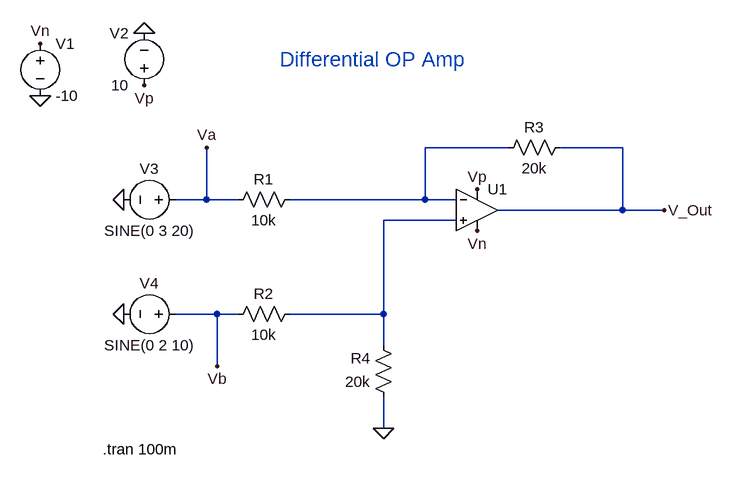
[diagram p0: schematic Differential_OP_Amp.asc]
Differential_OP_Amp.asc, the LTspice schematic file:
Version 4.1
SHEET 1 880 680
WIRE 256 48 128 48
WIRE 432 48 336 48
WIRE -208 128 -208 48
WIRE -208 128 -256 128
WIRE -160 128 -208 128
WIRE 128 128 128 48
WIRE 128 128 -80 128
WIRE 176 128 128 128
WIRE 432 144 432 48
WIRE 432 144 240 144
WIRE 496 144 432 144
WIRE 176 160 64 160
WIRE -192 304 -256 304
WIRE -160 304 -192 304
WIRE 64 304 64 160
WIRE 64 304 -80 304
WIRE 64 352 64 304
WIRE -192 384 -192 304
WIRE 64 480 64 432
FLAG -304 -128 0
FLAG -464 -32 0
FLAG -336 128 0
FLAG -336 304 0
FLAG -208 48 Va
FLAG -192 384 Vb
FLAG 496 144 V_Out
FLAG -304 -48 Vp
FLAG 208 112 Vp
FLAG -464 -112 Vn
FLAG 208 176 Vn
FLAG 64 480 0
SYMBOL OpAmps\\UniversalOpAmp2 208 144 R0
SYMATTR InstName U1
SYMBOL voltage -464 -128 R0
WINDOW 123 0 0 Left 0
WINDOW 39 0 0 Left 0
SYMATTR InstName V1
SYMATTR Value -10
SYMBOL voltage -304 -32 R180
WINDOW 0 24 96 Left 2
WINDOW 3 24 16 Left 2
WINDOW 123 0 0 Left 0
WINDOW 39 0 0 Left 0
SYMATTR InstName V2
SYMATTR Value 10
SYMBOL voltage -240 128 R90
WINDOW 0 -32 56 VBottom 2
WINDOW 3 32 56 VTop 2
WINDOW 123 0 0 Left 0
WINDOW 39 0 0 Left 0
SYMATTR InstName V3
SYMATTR Value SINE(0 3 20)
SYMBOL voltage -240 304 R90
WINDOW 0 -32 56 VBottom 2
WINDOW 3 32 56 VTop 2
WINDOW 123 0 0 Left 0
WINDOW 39 0 0 Left 0
SYMATTR InstName V4
SYMATTR Value SINE(0 2 10)
SYMBOL res -64 112 R90
WINDOW 0 0 56 VBottom 2
WINDOW 3 32 56 VTop 2
SYMATTR InstName R1
SYMATTR Value 10k
SYMBOL res -64 288 R90
WINDOW 0 0 56 VBottom 2
WINDOW 3 32 56 VTop 2
SYMATTR InstName R2
SYMATTR Value 10k
SYMBOL res 80 448 R180
WINDOW 0 36 76 Left 2
WINDOW 3 36 40 Left 2
SYMATTR InstName R4
SYMATTR Value 20k
SYMBOL res 240 64 R270
WINDOW 0 32 56 VTop 2
WINDOW 3 0 56 VBottom 2
SYMATTR InstName R3
SYMATTR Value 20k
TEXT -368 512 Left 2 !.tran 100m
TEXT -96 -88 Left 3 ;Differential OP Amp

The netlist it stands for:
* Differential_OP_Amp.asc
X§U1 N002 N001 Vp Vn V_Out level2 Avol=1Meg GBW=10Meg Slew=10Meg Ilimit=25m Rail=0 Vos=0 En=0 Enk=0 In=0 Ink=0 Rin=500Meg  ; pins In+ In- V+ V- OUT
V1 Vn 0 -10
V2 Vp 0 10
V3 Va 0 SINE(0 3 20)
V4 Vb 0 SINE(0 2 10)
R1 N001 Va 10k
R2 N002 Vb 10k
R4 0 N002 20k
R3 N001 V_Out 20k
.tran 100m
* Differential OP Amp
.lib UniversalOpAmp2.lib
.backanno
.end